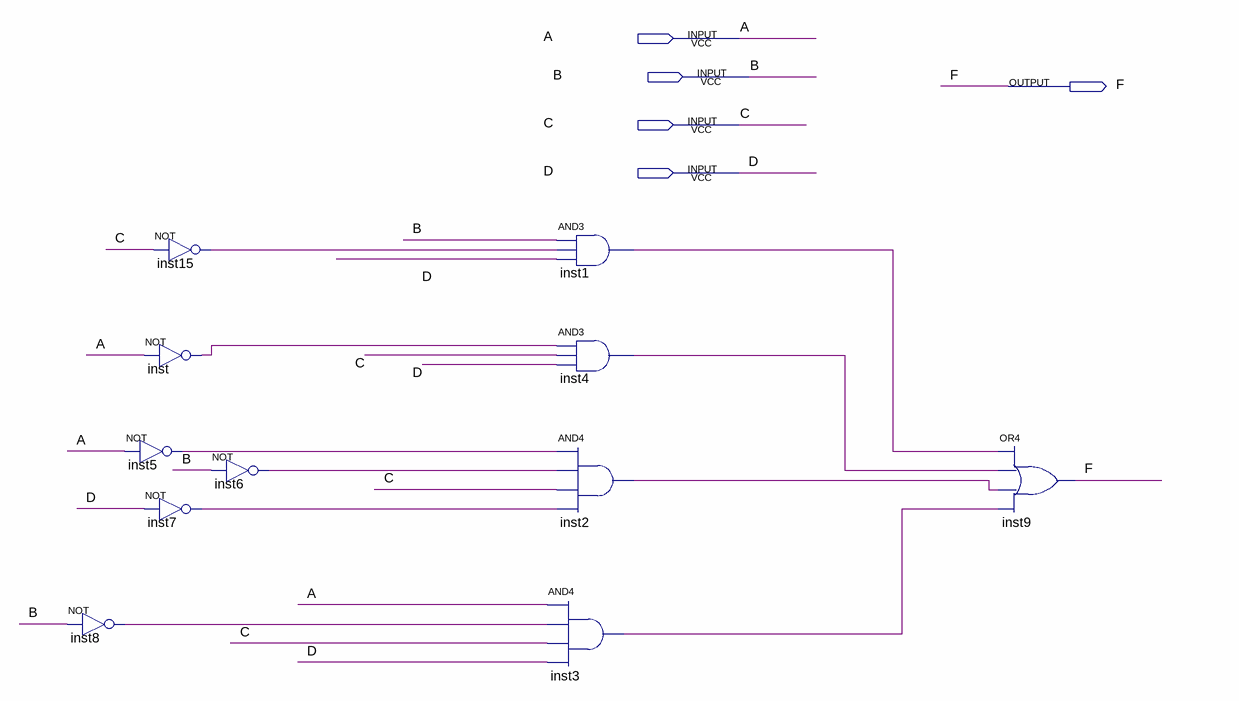
[diagram p0: schematic sheet]
// Quartus schematic prime.bdf as structural Verilog: 11 symbols, 5 pins
module prime (
  input  A,
  input  B,
  input  C,
  input  D,
  output F
);

  wire inst1_out, inst2_out, inst3_out, inst4_out, inst5_out, inst6_out, inst7_out, inst8_out, inst15_out,
       inst_out;

  not inst8 (inst8_out, B);
  not inst15 (inst15_out, C);
  not inst (inst_out, A);
  not inst5 (inst5_out, A);
  not inst7 (inst7_out, D);
  not inst6 (inst6_out, B);
  and inst3 (inst3_out, A, inst8_out, C, D);
  and inst1 (inst1_out, B, inst15_out, D);
  and inst4 (inst4_out, inst_out, C, D);
  and inst2 (inst2_out, inst5_out, inst6_out, C, inst7_out);
  or inst9 (F, inst1_out, inst4_out, inst2_out, inst3_out);
endmodule
